# EAGLE design PGTN016_slope (EAGLE 8.5.2)
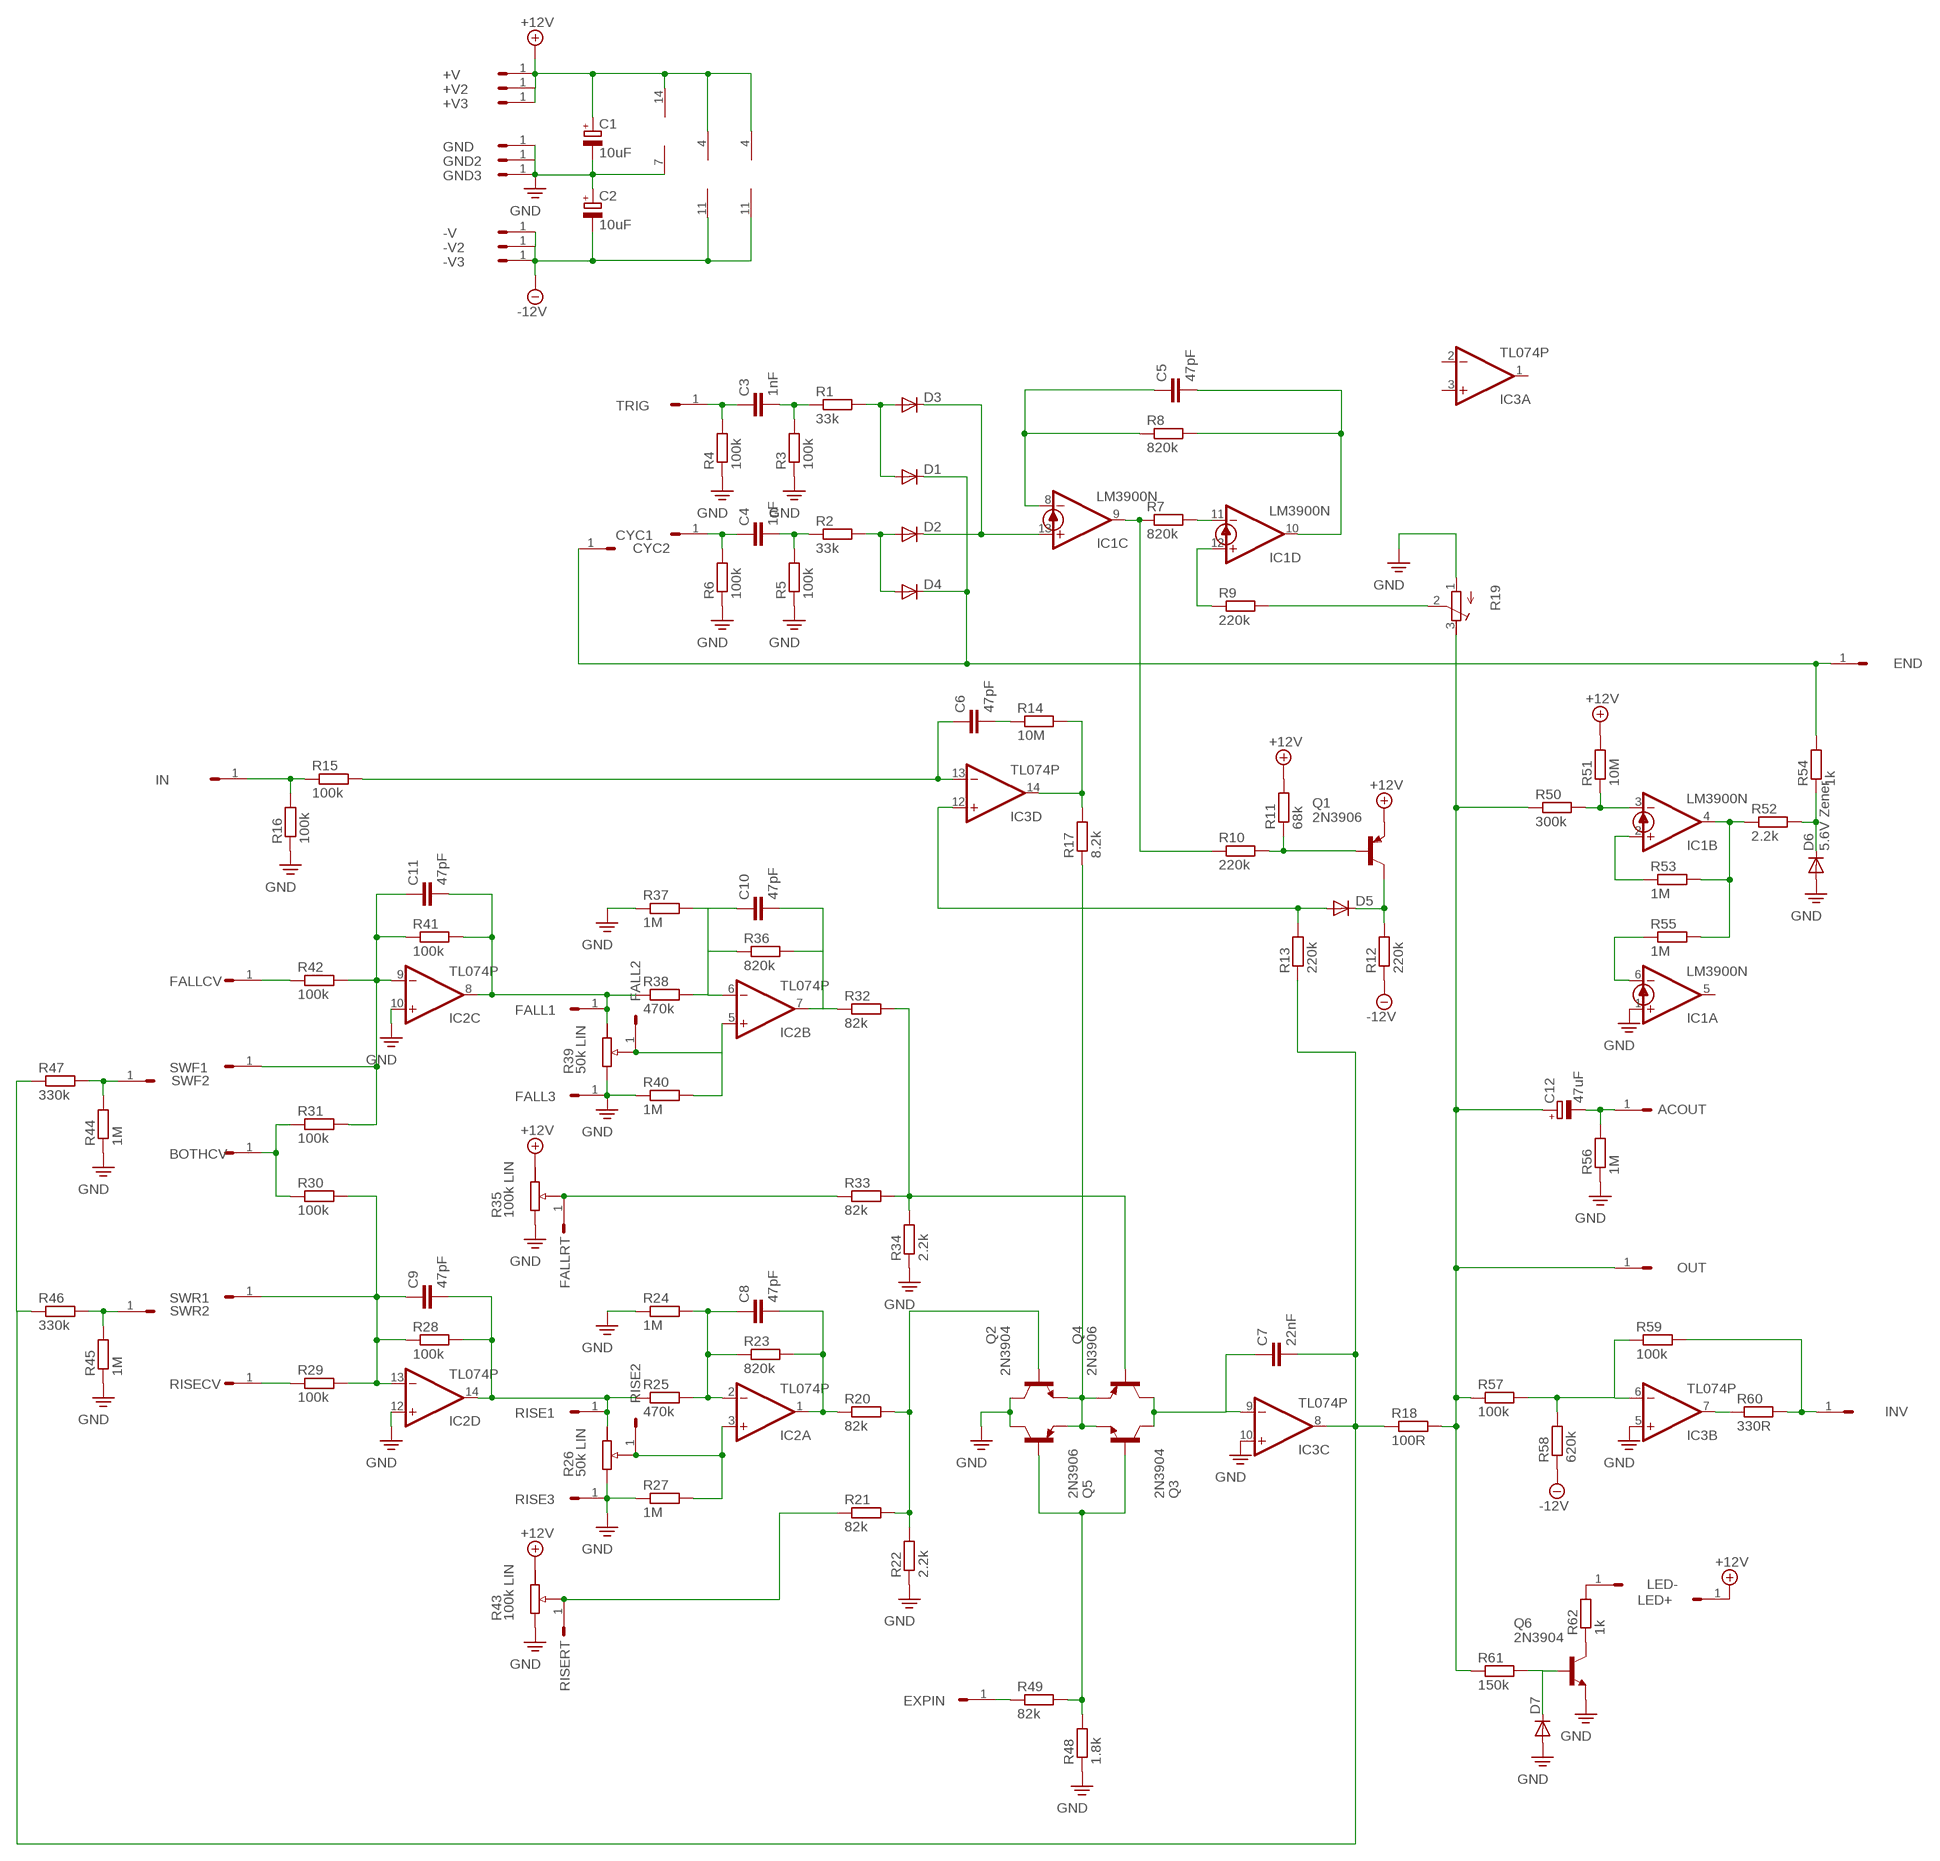
[diagram p0: schematic, sheet 1]

## Parts
+V  HEADER/MALE/01  [HEADER/MALE/01]
+V2  HEADER/MALE/01  [HEADER/MALE/01]
+V3  HEADER/MALE/01  [HEADER/MALE/01]
-V  HEADER/MALE/01  [HEADER/MALE/01]
-V2  HEADER/MALE/01  [HEADER/MALE/01]
-V3  HEADER/MALE/01  [HEADER/MALE/01]
ACOUT  HEADER/MALE/01  [HEADER/MALE/01]
BOTHCV  HEADER/MALE/01  [HEADER/MALE/01]
C1  10uF  CAPACITOR/POLARIZEDE2.5-6  [E2,5-6]
C2  10uF  CAPACITOR/POLARIZEDE2.5-6  [E2,5-6]
C3  1nF  CAPACITORCERAMICDISC/5  [CERAMICDISC/5]
C4  1nF  CAPACITORCERAMICDISC/5  [CERAMICDISC/5]
C5  47pF  CAPACITORCERAMICDISC/5  [CERAMICDISC/5]
C6  47pF  CAPACITORCERAMICDISC/5  [CERAMICDISC/5]
C7  22nF  CAPACITORCERAMICDISC/5  [CERAMICDISC/5]
C8  47pF  CAPACITORCERAMICDISC/5  [CERAMICDISC/5]
C9  47pF  CAPACITORCERAMICDISC/5  [CERAMICDISC/5]
C10  47pF  CAPACITORCERAMICDISC/5  [CERAMICDISC/5]
C11  47pF  CAPACITORCERAMICDISC/5  [CERAMICDISC/5]
C12  47uF  CAPACITOR/POLARIZEDE2.5-6  [E2,5-6]
CYC1  HEADER/MALE/01  [HEADER/MALE/01]
CYC2  HEADER/MALE/01  [HEADER/MALE/01]
D1  1N4148DO35-7  [DO35-7]
D2  1N4148DO35-7  [DO35-7]
D3  1N4148DO35-7  [DO35-7]
D4  1N4148DO35-7  [DO35-7]
D5  1N4148DO35-7  [DO35-7]
D6  5.6V Zener  1N4148DO35-7  [DO35-7]
D7  1N4148DO35-7  [DO35-7]
END  HEADER/MALE/01  [HEADER/MALE/01]
EXPIN  HEADER/MALE/01  [HEADER/MALE/01]
FALL1  HEADER/MALE/01  [HEADER/MALE/01]
FALL2  HEADER/MALE/01  [HEADER/MALE/01]
FALL3  HEADER/MALE/01  [HEADER/MALE/01]
FALLCV  HEADER/MALE/01  [HEADER/MALE/01]
FALLRT  HEADER/MALE/01  [HEADER/MALE/01]
GND  HEADER/MALE/01  [HEADER/MALE/01]
GND2  HEADER/MALE/01  [HEADER/MALE/01]
GND3  HEADER/MALE/01  [HEADER/MALE/01]
IC1  LM3900N  [DIL14]
IC2  TL074P  [DIL14]
IC3  TL074P  [DIL14]
IN  HEADER/MALE/01  [HEADER/MALE/01]
INV  HEADER/MALE/01  [HEADER/MALE/01]
LED+  HEADER/MALE/01  [HEADER/MALE/01]
LED-  HEADER/MALE/01  [HEADER/MALE/01]
OUT  HEADER/MALE/01  [HEADER/MALE/01]
Q1  2N3906  [TO92]
Q2  2N3904  [TO92]
Q3  2N3904  [TO92]
Q4  2N3906  [TO92]
Q5  2N3906  [TO92]
Q6  2N3904  [TO92]
R1  33k  RESISTORRESISTOR/UPRIGHT/7.5  [RESISTOR/7.5]
R2  33k  RESISTORRESISTOR/UPRIGHT/7.5  [RESISTOR/7.5]
R3  100k  RESISTORRESISTOR/UPRIGHT/7.5  [RESISTOR/7.5]
R4  100k  RESISTORRESISTOR/UPRIGHT/7.5  [RESISTOR/7.5]
R5  100k  RESISTORRESISTOR/UPRIGHT/7.5  [RESISTOR/7.5]
R6  100k  RESISTORRESISTOR/UPRIGHT/7.5  [RESISTOR/7.5]
R7  820k  RESISTORRESISTOR/UPRIGHT/7.5  [RESISTOR/7.5]
R8  820k  RESISTORRESISTOR/UPRIGHT/7.5  [RESISTOR/7.5]
R9  220k  RESISTORRESISTOR/UPRIGHT/7.5  [RESISTOR/7.5]
R10  220k  RESISTORRESISTOR/UPRIGHT/7.5  [RESISTOR/7.5]
R11  68k  RESISTORRESISTOR/UPRIGHT/7.5  [RESISTOR/7.5]
R12  220k  RESISTORRESISTOR/UPRIGHT/7.5  [RESISTOR/7.5]
R13  220k  RESISTORRESISTOR/UPRIGHT/7.5  [RESISTOR/7.5]
R14  10M  RESISTORRESISTOR/UPRIGHT/7.5  [RESISTOR/7.5]
R15  100k  RESISTORRESISTOR/UPRIGHT/7.5  [RESISTOR/7.5]
R16  100k  RESISTORRESISTOR/UPRIGHT/7.5  [RESISTOR/7.5]
R17  8.2k  RESISTORRESISTOR/UPRIGHT/7.5  [RESISTOR/7.5]
R18  100R  RESISTORRESISTOR/UPRIGHT/7.5  [RESISTOR/7.5]
R19  TRIMMER64X  [TRIMMER/64B]
R20  82k  RESISTORRESISTOR/UPRIGHT/7.5  [RESISTOR/7.5]
R21  82k  RESISTORRESISTOR/UPRIGHT/7.5  [RESISTOR/7.5]
R22  2.2k  RESISTORRESISTOR/UPRIGHT/7.5  [RESISTOR/7.5]
R23  820k  RESISTORRESISTOR/UPRIGHT/7.5  [RESISTOR/7.5]
R24  1M  RESISTORRESISTOR/UPRIGHT/7.5  [RESISTOR/7.5]
R25  470k  RESISTORRESISTOR/UPRIGHT/7.5  [RESISTOR/7.5]
R26  50k LIN  POTENTIOMETER  (no package)
R27  1M  RESISTORRESISTOR/UPRIGHT/7.5  [RESISTOR/7.5]
R28  100k  RESISTORRESISTOR/UPRIGHT/7.5  [RESISTOR/7.5]
R29  100k  RESISTORRESISTOR/UPRIGHT/7.5  [RESISTOR/7.5]
R30  100k  RESISTORRESISTOR/UPRIGHT/7.5  [RESISTOR/7.5]
R31  100k  RESISTORRESISTOR/UPRIGHT/7.5  [RESISTOR/7.5]
R32  82k  RESISTORRESISTOR/UPRIGHT/7.5  [RESISTOR/7.5]
R33  82k  RESISTORRESISTOR/UPRIGHT/7.5  [RESISTOR/7.5]
R34  2.2k  RESISTORRESISTOR/UPRIGHT/7.5  [RESISTOR/7.5]
R35  100k LIN  POTENTIOMETER  (no package)
R36  820k  RESISTORRESISTOR/UPRIGHT/7.5  [RESISTOR/7.5]
R37  1M  RESISTORRESISTOR/UPRIGHT/7.5  [RESISTOR/7.5]
R38  470k  RESISTORRESISTOR/UPRIGHT/7.5  [RESISTOR/7.5]
R39  50k LIN  POTENTIOMETER  (no package)
R40  1M  RESISTORRESISTOR/UPRIGHT/7.5  [RESISTOR/7.5]
R41  100k  RESISTORRESISTOR/UPRIGHT/7.5  [RESISTOR/7.5]
R42  100k  RESISTORRESISTOR/UPRIGHT/7.5  [RESISTOR/7.5]
R43  100k LIN  POTENTIOMETER  (no package)
R44  1M  RESISTORRESISTOR/UPRIGHT/7.5  [RESISTOR/7.5]
R45  1M  RESISTORRESISTOR/UPRIGHT/7.5  [RESISTOR/7.5]
R46  330k  RESISTORRESISTOR/UPRIGHT/7.5  [RESISTOR/7.5]
R47  330k  RESISTORRESISTOR/UPRIGHT/7.5  [RESISTOR/7.5]
R48  1.8k  RESISTORRESISTOR/UPRIGHT/7.5  [RESISTOR/7.5]
R49  82k  RESISTORRESISTOR/UPRIGHT/7.5  [RESISTOR/7.5]
R50  300k  RESISTORRESISTOR/UPRIGHT/7.5  [RESISTOR/7.5]
R51  10M  RESISTORRESISTOR/UPRIGHT/7.5  [RESISTOR/7.5]
R52  2.2k  RESISTORRESISTOR/UPRIGHT/7.5  [RESISTOR/7.5]
R53  1M  RESISTORRESISTOR/UPRIGHT/7.5  [RESISTOR/7.5]
R54  1k  RESISTORRESISTOR/UPRIGHT/7.5  [RESISTOR/7.5]
R55  1M  RESISTORRESISTOR/UPRIGHT/7.5  [RESISTOR/7.5]
R56  1M  RESISTORRESISTOR/UPRIGHT/7.5  [RESISTOR/7.5]
R57  100k  RESISTORRESISTOR/UPRIGHT/7.5  [RESISTOR/7.5]
R58  620k  RESISTORRESISTOR/UPRIGHT/7.5  [RESISTOR/7.5]
R59  100k  RESISTORRESISTOR/UPRIGHT/7.5  [RESISTOR/7.5]
R60  330R  RESISTORRESISTOR/UPRIGHT/7.5  [RESISTOR/7.5]
R61  150k  RESISTORRESISTOR/UPRIGHT/7.5  [RESISTOR/7.5]
R62  1k  RESISTORRESISTOR/UPRIGHT/7.5  [RESISTOR/7.5]
RISE1  HEADER/MALE/01  [HEADER/MALE/01]
RISE2  HEADER/MALE/01  [HEADER/MALE/01]
RISE3  HEADER/MALE/01  [HEADER/MALE/01]
RISECV  HEADER/MALE/01  [HEADER/MALE/01]
RISERT  HEADER/MALE/01  [HEADER/MALE/01]
SWF1  HEADER/MALE/01  [HEADER/MALE/01]
SWF2  HEADER/MALE/01  [HEADER/MALE/01]
SWR1  HEADER/MALE/01  [HEADER/MALE/01]
SWR2  HEADER/MALE/01  [HEADER/MALE/01]
TRIG  HEADER/MALE/01  [HEADER/MALE/01]

## Nets
+12V: +V2.1 +V3.1 +V.1 C1.+ IC1.14(P:V+) IC2.4(P:V+) IC3.4(P:V+) LED+.1 Q1.3(E) R11.2 R35.A R43.A R51.2
-12V: -V2.1 -V3.1 -V.1 C2.- IC2.11(P:V-) IC3.11(P:V-) R12.1 R58.1
GND: C1.- C2.+ D6.A D7.A FALL3.1 GND2.1 GND3.1 GND.1 IC1.1(A:+IN) IC1.7(P:GND) IC2.10(C:+IN) IC2.12(D:+IN) IC3.5(B:+IN) IC3.10(C:+IN) Q2.1(C) Q5.1(C) Q6.3(E) R3.1 R4.1 R5.1 R6.1 R16.1 R19.1(E) R22.1 R24.1 R26.E R27.1 R34.1 R35.E R37.1 R39.E R40.1 R43.E R44.1 R45.1 R48.1 R56.1 RISE3.1
N$1: C4.2 R2.1 R5.2
N$2: C4.1 CYC1.1 R6.2
N$3: D2.C D3.C IC1.13(C:+IN)
N$4: Q1.2(B) R10.2 R11.1
N$5: CYC2.1 D1.C D4.C END.1 R54.2
N$6: D2.A D4.A R2.2
N$7: D1.A D3.A R1.2
N$8: C3.2 R1.1 R3.2
N$9: C3.1 R4.2 TRIG.1
N$10: IC1.9(C:OUT) R7.1 R10.1
N$11: IC1.11(D:-IN) R7.2
N$12: C5.2 IC1.10(D:OUT) R8.2
N$13: C5.1 IC1.8(C:-IN) R8.1
N$14: IC1.12(D:+IN) R9.1
N$15: D5.C Q1.1(C) R12.2
N$16: D5.A IC3.12(D:+IN) R13.2
N$17: Q2.3(E) Q3.3(E) Q4.3(E) Q5.3(E) R17.1
N$18: IC3.14(D:OUT) R14.2 R17.2
N$19: C6.2 R14.1
N$20: C6.1 IC3.13(D:-IN) R15.2
N$21: IN.1 R15.1 R16.2
N$22: EXPIN.1 R49.1
N$23: C7.1 IC3.9(C:-IN) Q3.1(C) Q4.1(C)
N$24: C12.+ OUT.1 R18.2 R19.3(A) R50.1 R57.1 R61.1
N$25: Q3.2(B) Q5.2(B) R48.2 R49.2
N$26: R9.2 R19.2(S)
N$27: IC2.3(A:+IN) R26.S R27.2 RISE2.1
N$28: Q2.2(B) R20.2 R21.2 R22.2
N$29: C8.2 IC2.1(A:OUT) R20.1 R23.2
N$30: C8.1 IC2.2(A:-IN) R23.1 R24.2 R25.2
N$31: BOTHCV.1 R30.1 R31.1
N$32: C10.2 IC2.7(B:OUT) R32.1 R36.2
N$33: Q4.2(B) R32.2 R33.2 R34.2
N$34: C9.2 IC2.14(D:OUT) R25.1 R26.A R28.2 RISE1.1
N$35: C9.1 IC2.13(D:-IN) R28.1 R29.2 R30.2 SWR1.1
N$36: R29.1 RISECV.1
N$37: C10.1 IC2.6(B:-IN) R36.1 R37.2 R38.2
N$38: FALLRT.1 R33.1 R35.S
N$39: FALL2.1 IC2.5(B:+IN) R39.S R40.2
N$40: C11.1 IC2.9(C:-IN) R31.2 R41.1 R42.2 SWF1.1
N$41: R21.1 R43.S RISERT.1
N$42: C11.2 FALL1.1 IC2.8(C:OUT) R38.1 R39.A R41.2
N$43: FALLCV.1 R42.1
N$44: R45.2 R46.2 SWR2.1
N$45: R44.2 R47.2 SWF2.1
N$46: C7.2 IC3.8(C:OUT) R13.1 R18.1 R46.1 R47.1
N$47: IC1.3(B:-IN) R50.2 R51.1
N$48: IC1.4(B:OUT) R52.1 R53.2 R55.2
N$49: IC1.6(A:-IN) R55.1
N$50: IC1.2(B:+IN) R53.1
N$51: D6.C R52.2 R54.1
N$52: ACOUT.1 C12.- R56.2
N$53: IC3.6(B:-IN) R57.2 R58.2 R59.1
N$54: IC3.7(B:OUT) R60.1
N$55: INV.1 R59.2 R60.2
N$57: D7.C Q6.2(B) R61.2
N$58: Q6.1(C) R62.1
N$59: LED-.1 R62.2
Unconnected: IC1.5(A:OUT) IC3.1(A:OUT) IC3.2(A:-IN) IC3.3(A:+IN)

## Library data of the parts
+V +V2 +V3 -V -V2 -V3 ACOUT BOTHCV CYC1 CYC2 END EXPIN FALL1-FALL3 FALLCV FALLRT GND GND2 GND3 IN INV LED+ LED- OUT RISE1-RISE3 RISECV RISERT SWF1 SWF2 SWR1 SWR2 TRIG = connectors:HEADER/MALE/01; SPICEPREFIX: X
C1 C2 = capacitors:CAPACITOR/POLARIZED: POLARIZED CAPACITOR, European symbol; SPICEPREFIX: C
C3-C11 = capacitors:CAPACITOR: CAPACITOR, European symbol
C12 = capacitors:CAPACITOR/POLARIZED: POLARIZED CAPACITOR, European symbol
D1-D7 = transistors:1N4148: DIODE high speed (Philips)
IC1 = ic_analogue:LM3900: OP AMP
IC2 IC3 = ic_analogue:TL074: OP AMP
Q1 Q4 Q5 = transistors:2N3906: PNP Transistor
Q2 Q3 Q6 = transistors:2N3904: NPN Transistor
R1-R18 R20-R25 R27-R34 R36-R38 R40-R42 R44-R62 = resistors:RESISTOR: RESISTOR, European symbol
R19 = resistors:TRIMMER: Trimm resistor
R26 R35 R39 R43 = controls_off_brd:POTENTIOMETER: Trimm resistor; _EXTERNAL_: 1

## Board
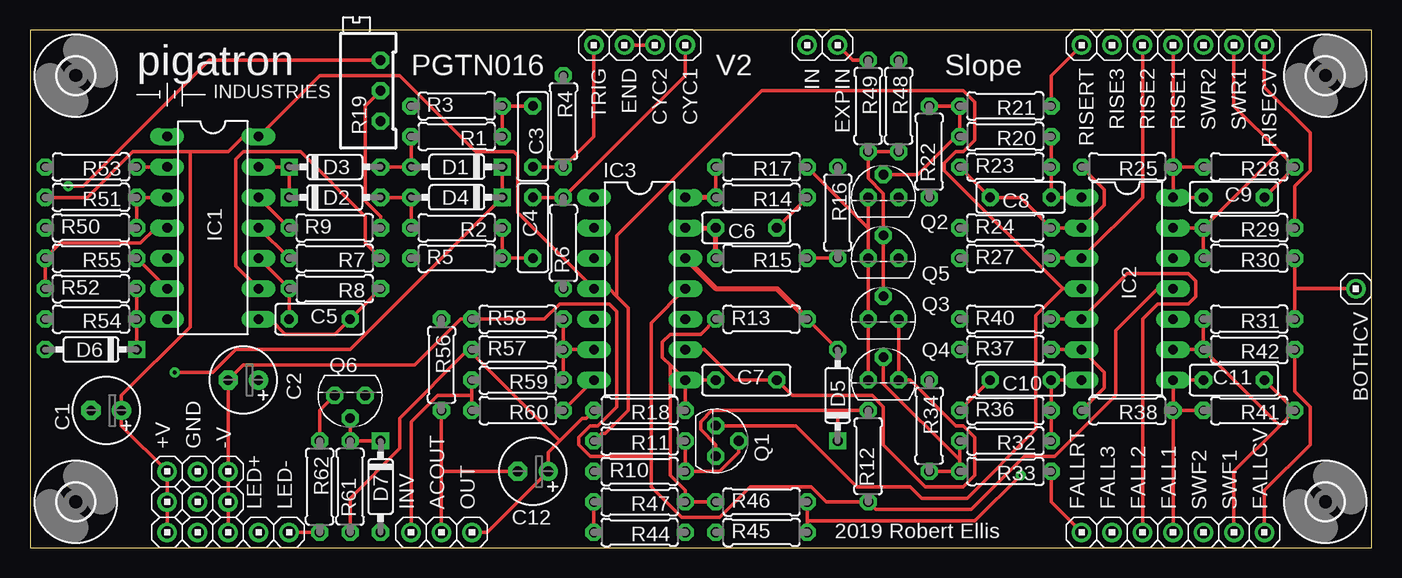
[diagram p1: board, top side]
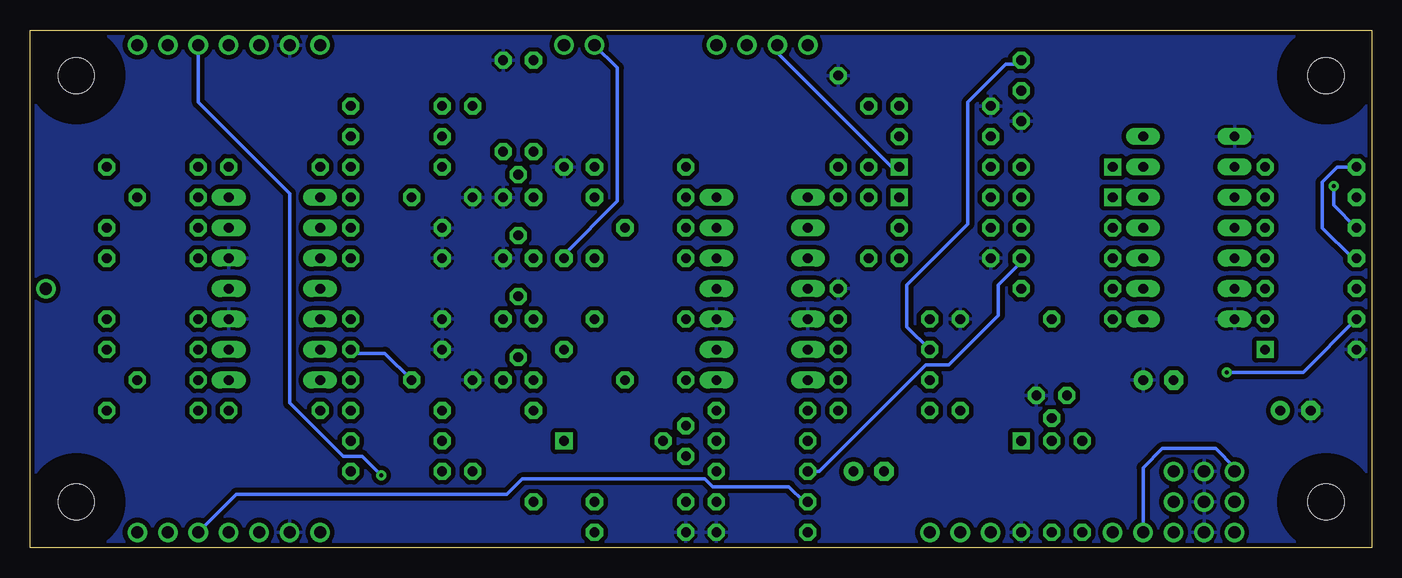
[diagram p2: board, bottom side, seen from below]

Size 111.81 x 43.17 mm. Coordinates in mm from the lower left corner, seen from the top.
Outline: 0,0 111.81,0 111.81,43.17 0,43.17 0,0
Copper layers (1*16): Top 0.0356mm / dielectric 1.5011mm / Bottom 0.0356mm
Design rules "pigatron": minimum track width 12mil, minimum drill 13mil, track to track 15mil, track to pad 10mil, pad to pad 10mil, via to via 10mil, smd to smd 6mil, copper to edge 15mil, drill to drill 10mil, minimum pad ring 12mil, minimum via ring 10mil, stop-mask expansion 4mil, vias tented up to drill 0mil, thermal gap 10mil

### Footprints (pad centres in the part's own frame; a part is rotated, then mirrored left to right if it is on the bottom)
HEADER/MALE/01 = drill 1.016: 1 0,0
E2,5-6 = drill 0.813 pad 1.6: + -1.27,0 | drill 0.813 pad 1.6 octagon: - 1.27,0
CERAMICDISC/5 = drill 0.813 octagon: 1 -2.54,0; 2 2.54,0
DO35-7 = drill 0.813 octagon: A 3.81,0 | drill 0.813 square: C -3.81,0
DIL14 = drill 0.813 long: 1 -7.62,-3.81; 2 -5.08,-3.81; 3 -2.54,-3.81; 4 0,-3.81; 5 2.54,-3.81; 6 5.08,-3.81; 7 7.62,-3.81; 8 7.62,3.81; 9 5.08,3.81; 10 2.54,3.81; 11 0,3.81; 12 -2.54,3.81; 13 -5.08,3.81; 14 -7.62,3.81
TO92 = drill 0.813 octagon: 1 1.27,0; 2 0,1.905; 3 -1.27,0
RESISTOR/7.5 = drill 0.813 octagon: 1 -3.81,0; 2 3.81,0
TRIMMER/64B = drill 0.813 octagon: 1 1.27,-2.54; 2 1.27,0; 3 1.27,2.54
STANDOFF/3.0 = hole 3: 0,0

### Placement (x,y rotation side)
+V  11.43,6.35 90 top
+V2  11.43,3.81 90 top
+V3  11.43,1.27 90 top
-V  16.51,6.35 90 top
-V2  16.51,3.81 90 top
-V3  16.51,1.27 90 top
ACOUT  34.29,1.27 90 top
BOTHCV  110.49,21.59 270 top
C1  6.35,11.43 180 top
C2  17.78,13.97 180 top
C3  41.91,34.29 90 top
C4  41.91,26.67 270 top
C5  24.13,19.05 180 top
C6  59.69,26.67 0 top
C7  59.69,13.97 180 top
C8  82.55,29.21 0 top
C9  100.33,29.21 180 top
C10  82.55,13.97 0 top
C11  100.33,13.97 180 top
C12  41.91,6.35 180 top
CYC1  54.61,41.91 270 top
CYC2  52.07,41.91 270 top
D1  35.56,31.75 180 top
D2  25.4,29.21 0 top
D3  25.4,31.75 0 top
D4  35.56,29.21 180 top
D5  67.31,12.7 90 top
D6  5.08,16.51 180 top
D7  29.21,5.08 270 top
END  49.53,41.91 270 top
EXPIN  67.31,41.91 270 top
FALL1  95.25,1.27 90 top
FALL2  92.71,1.27 90 top
FALL3  90.17,1.27 90 top
FALLCV  102.87,1.27 90 top
FALLRT  87.63,1.27 90 top
GND  13.97,6.35 90 top
GND2  13.97,1.27 90 top
GND3  13.97,3.81 90 top
IC1  15.24,26.67 270 top
IC2  91.44,21.59 270 top
IC3  50.8,21.59 270 top
IN  64.77,41.91 270 top
INV  31.75,1.27 90 top
LED+  19.05,1.27 90 top
LED-  21.59,1.27 90 top
OUT  36.83,1.27 90 top
Q1  57.15,8.89 270 top
Q2  71.12,29.21 0 top
Q3  71.12,19.05 0 top
Q4  71.12,13.97 0 top
Q5  71.12,24.13 0 top
Q6  26.67,12.7 180 top
R1  35.56,34.29 180 top
R2  35.56,26.67 180 top
R3  35.56,36.83 0 top
R4  44.45,35.56 270 top
R5  35.56,24.13 0 top
R6  44.45,25.4 90 top
R7  25.4,24.13 180 top
R8  25.4,21.59 180 top
R9  25.4,26.67 0 top
R10  50.8,6.35 0 top
R11  50.8,8.89 180 top
R12  69.85,7.62 90 top
R13  60.96,19.05 0 top
R14  60.96,29.21 180 top
R15  60.96,24.13 180 top
R16  67.31,27.94 270 top
R17  60.96,31.75 180 top
R18  50.8,11.43 180 top
R19  27.94,38.1 0 top
R20  81.28,34.29 180 top
R21  81.28,36.83 180 top
R22  74.93,33.02 90 top
R23  81.28,31.75 0 top
R24  81.28,26.67 0 top
R25  91.44,31.75 180 top
R27  81.28,24.13 0 top
R28  101.6,31.75 180 top
R29  101.6,26.67 180 top
R30  101.6,24.13 180 top
R31  101.6,19.05 180 top
R32  81.28,8.89 180 top
R33  81.28,6.35 180 top
R34  74.93,10.16 270 top
R36  81.28,11.43 0 top
R37  81.28,16.51 0 top
R38  91.44,11.43 180 top
R40  81.28,19.05 0 top
R41  101.6,11.43 180 top
R42  101.6,16.51 180 top
R44  50.8,1.27 180 top
R45  60.96,1.27 0 top
R46  60.96,3.81 0 top
R47  50.8,3.81 180 top
R48  72.39,36.83 270 top
R49  69.85,36.83 270 top
R50  5.08,26.67 0 top
R51  5.08,29.21 180 top
R52  5.08,21.59 0 top
R53  5.08,31.75 180 top
R54  5.08,19.05 180 top
R55  5.08,24.13 180 top
R56  34.29,15.24 270 top
R57  40.64,16.51 0 top
R58  40.64,19.05 0 top
R59  40.64,13.97 180 top
R60  40.64,11.43 180 top
R61  26.67,5.08 90 top
R62  24.13,5.08 270 top
RISE1  95.25,41.91 270 top
RISE2  92.71,41.91 270 top
RISE3  90.17,41.91 270 top
RISECV  102.87,41.91 270 top
RISERT  87.63,41.91 270 top
SWF1  100.33,1.27 90 top
SWF2  97.79,1.27 90 top
SWR1  100.33,41.91 270 top
SWR2  97.79,41.91 270 top
TRIG  46.99,41.91 270 top
U$1  [STANDOFF/3.0]  107.95,3.81 0 top
U$2  [STANDOFF/3.0]  107.95,39.37 0 top
U$3  [STANDOFF/3.0]  3.81,3.81 0 top
U$4  [STANDOFF/3.0]  3.81,39.37 0 top
U$5  [PIGATRON-LOGO]  17.78,39.37 0 top

### Tracks (layer width: path | path; a pad name or v marks a point on that pad's centre or on a via)
+12V
  Top 0.305: Q1.3 63.82,10.16 68.9,5.08 73.34,5.08 74.3,4.13 78.11,4.13 83.82,9.84 83.82,19.37 86.04,21.59 | IC2.4 86.04,21.59 | R11.2 47.62,9.53 47.94,9.53 49.85,11.43 49.85,20 48.89,20.95 | 48.89,20.95 48.26,21.59 IC3.4 40.64,27.94 40.64,32.7 40.32,33.02 37.15,33.02 30.8,39.37 24.13,39.37 IC1.14 17.78,34.29 16.51,33.02 13.33,33.02 | R51.2 4.76,29.21 8.57,33.02 13.33,33.02 | 13.33,33.02 13.33,18.41 7.62,12.7 C1.+ 7.62,10.16 +V.1 +V2.1 +V3.1 | 86.04,21.59 76.2,31.43 76.2,32.07 77.15,33.02 77.79,33.02 78.74,33.97 78.74,37.15 77.79,38.1 60.96,38.1 48.89,26.03 48.89,20.95
  Bottom 0.305: LED+.1 19.05,6.67 17.46,8.26 13.02,8.26 11.43,6.67 +V.1
-12V
  Top 0.305: -V3.1 -V2.1 -V.1 C2.- 17.78,15.24 32.07,15.24 35.88,19.05 R58.1 42.86,19.05 44.13,20.32 48.26,20.32 48.89,19.69 48.89,11.75 47.31,10.16 46.67,10.16 45.72,9.21 45.72,8.57 46.67,7.62 51.75,7.62 | 51.75,7.62 51.75,18.73 IC3.11 | 51.75,7.62 51.75,5.08 54.29,2.54 57.47,2.54 60.01,5.08 65.09,5.08 66.36,3.81 R12.1 70.48,3.18 78.42,3.18 82.87,7.62 85.41,7.62 90.49,12.7 90.49,18.1 93.98,21.59 IC2.11
GND
  pour Bottom: 0,43.18 0,0 111.76,0 111.76,43.18
N$1
  Top 0.305: R2.1 R5.2 C4.2
N$2
  Top 0.305: C4.1 R6.2 54.61,39.37 CYC1.1
N$3
  Top 0.305: IC1.13 D3.C D2.C
N$4
  Top 0.305: R11.1 R10.2 57.47,6.35 59.05,7.94 Q1.2
N$5  (via drill 0.33)
  Top 0.305: D1.C D4.C 26.67,16.51 17.14,16.51 15.24,14.6 v12.06,14.6 | CYC2.1 END.1
  Bottom 0.305: END.1 49.53,41.27 40,31.75 D1.C | R54.2 5.71,14.6 v12.06,14.6
N$6
  Top 0.305: R2.2 D4.A D2.A
N$7
  Top 0.305: D3.A D1.A R1.2
N$8
  Top 0.305: R1.1 R3.2 C3.2
N$9
  Top 0.305: C3.1 R4.2 46.99,34.29 TRIG.1
N$10
  Top 0.305: IC1.9 17.14,23.49 17.14,32.38 17.78,33.02 22.54,33.02 27.94,27.62 27.94,25.4 R7.1
  Bottom 0.305: R10.1 46.04,6.35 37.15,15.24 35.24,15.24 31.11,19.37 31.11,21.91 29.21,23.81 R7.1
N$11
  Top 0.305: R7.2 IC1.11
N$12
  Top 0.305: C5.2 R8.2 IC1.10
N$13
  Top 0.305: IC1.8 20,19.05 21.27,17.78 25.4,17.78 C5.1 R8.1
N$14
  Top 0.305: R9.1 IC1.12
N$15
  Top 0.305: Q1.1 57.15,8.57 55.88,9.84 55.88,10.48 56.83,11.43 67.31,11.43 | R12.2 67.31,11.43 | 67.31,11.43 D5.C
N$16
  Top 0.305: D5.A R13.2
  Top 0.406: IC3.12 57.15,21.59 62.23,21.59 R13.2
N$17
  Top 0.305: Q4.3 Q3.3 Q5.3 69.85,26.67 | Q2.3 69.85,26.67 | 69.85,26.67 R17.1
N$18
  Top 0.305: R14.2 R17.2
  Top 0.406: R14.2 IC3.14
N$19
  Top 0.305: R14.1 C6.2
N$20
  Top 0.406: IC3.13 C6.1 R15.2
N$21
  Top 0.305: R16.2 R15.1
  Bottom 0.305: IN.1 62.86,40 62.86,28.89 67.31,24.45 R16.2
N$22
  Top 0.305: R49.1 68.58,40.64 EXPIN.1
N$23
  Top 0.305: Q3.1 Q4.1 73.34,13.97 77.15,10.16 77.79,10.16 78.74,9.21 78.74,6.03 77.79,5.08 74.61,5.08 71.12,8.57 71.12,11.75 70.17,12.7 63.5,12.7 C7.1 58.74,13.97 56.2,16.51 IC3.9
N$24  (via drill 0.33)
  Top 0.305: R18.2 46.35,10.79 46.04,10.79 44.13,8.89 | 44.13,8.89 43.18,7.94 C12.+ 38.1,1.27 OUT.1 | R61.1 26.67,4.13 30.8,8.26 30.8,10.79 36.51,16.51 | 36.51,16.51 44.13,8.89 | 36.51,16.51 R57.1 | v3.18,30.16 4.45,30.16 14.92,40.64 R19.3
  Bottom 0.305: R50.1 3.18,28.57 v3.18,30.16 | R57.1 38.73,18.41 38.73,21.91 33.66,26.99 33.66,37.15 30.48,40.32 29.53,40.32 R19.3
N$25
  Top 0.305: R48.2 R49.2 69.85,30.8 71.12,29.53 Q5.2 Q3.2
N$26
  Top 0.305: R9.2 29.21,27.62 27.94,28.89 27.94,36.83 R19.2
N$27
  Top 0.305: R27.2 IC2.3 92.71,29.21 RISE2.1
N$28
  Top 0.305: R22.2 R21.2 R20.2 77.15,34.29 73.98,31.12 Q2.2
N$29
  Top 0.305: IC2.1 C8.2 R23.2 R20.1
N$30
  Top 0.305: R23.1 C8.1 82.55,29.21 R24.2 IC2.2 89.53,28.57 89.53,29.84 R25.2
N$31
  Top 0.305: R30.1 105.41,21.59 | 105.41,21.59 R31.1 | 105.41,21.59 BOTHCV.1
N$32
  Top 0.305: R32.1 R36.2 C10.2 IC2.7
N$33
  Top 0.305: R34.2 R33.2 77.47,7.3 | 77.47,7.3 R32.2 | Q4.2 71.12,13.65 77.47,7.3
N$34
  Top 0.305: R25.1 IC2.14 C9.2 | R25.1 R28.2 | R25.1 RISE1.1
N$35
  Top 0.305: R29.2 R30.2 | R29.2 IC2.13 | C9.1 R28.1 104.14,33.02 | SWR1.1 100.33,36.83 104.14,33.02 | 104.14,33.02 R29.2
N$36
  Top 0.305: R29.1 105.41,30.16 106.68,31.43 106.68,34.61 102.87,38.42 RISECV.1
N$37
  Top 0.305: C10.1 R36.1 | R38.2 89.53,13.33 89.53,14.6 IC2.6 R37.2
  Bottom 0.305: C10.1 82.23,16.19 84.77,16.19 R37.2
N$38
  Top 0.305: R33.1 85.09,3.81 FALLRT.1
N$39
  Top 0.305: R40.2 IC2.5 91.44,22.86 96.52,22.86 97.16,22.23 97.16,20.95 96.52,20.32 93.98,20.32 92.71,19.05 FALL2.1
N$40
  Top 0.305: R42.2 IC2.9 | R42.2 R31.2 | C11.1 R41.1 104.14,10.16 | SWF1.1 100.33,6.35 104.14,10.16 | 104.14,10.16 R42.2
N$41
  Top 0.305: R21.1 85.09,39.37 RISERT.1
N$42
  Top 0.305: R38.1 IC2.8 C11.2 | R38.1 R41.2 | R38.1 FALL1.1
N$43
  Top 0.305: R42.1 105.41,13.02 106.68,11.75 106.68,8.57 102.87,4.76 FALLCV.1
N$44  (via drill 0.33)
  Top 0.305: R46.2 64.77,2.22 | 64.77,2.22 R45.2 | v82.55,6.03 78.74,2.22 64.77,2.22
  Bottom 0.305: SWR2.1 97.79,37.15 90.17,29.53 90.17,12.06 85.72,7.62 84.14,7.62 v82.55,6.03
N$45
  Top 0.305: R47.2 R44.2
  Bottom 0.305: SWF2.1 94.61,4.45 72.07,4.45 70.8,5.71 55.56,5.71 54.93,5.08 48.58,5.08 47.31,3.81 R47.2
N$46
  Top 0.305: R46.1 R47.1 54.61,4.76 53.34,6.03 53.34,15.24 | IC3.8 R18.1 | IC3.8 C7.2 | R13.1 55.88,17.78 53.34,17.78 52.7,17.15 52.7,15.88 53.34,15.24 | IC3.8 53.34,15.24
N$47
  Top 0.305: R50.2 R51.1 IC1.3
N$48
  Top 0.305: R52.1 R55.2 2.54,25.4 9.21,25.4 10.48,26.67 IC1.4
  Bottom 0.305: R53.2 2.86,31.75 4.13,30.48 4.13,26.67 1.59,24.13 R55.2
N$49
  Top 0.305: IC1.6 R55.1
N$50
  Top 0.305: IC1.2 R53.1
N$51
  Top 0.305: D6.C R54.1 R52.2
N$52
  Top 0.305: ACOUT.1 34.29,6.35 | 34.29,6.35 R56.2 | 34.29,6.35 C12.-
N$53
  Top 0.305: R57.2 R59.1 | R57.2 IC3.6 | R57.2 R58.2
N$54
  Top 0.305: IC3.7 R60.1
N$55
  Top 0.305: R59.2 36.83,12.7 | 36.83,12.7 R60.2 | INV.1 31.75,10.48 33.97,12.7 36.83,12.7
N$57
  Top 0.305: Q6.2 R61.2 D7.C
N$58
  Top 0.305: R62.1 24.13,11.43 Q6.1
N$59
  Top 0.305: LED-.1 R62.2

### Text on the board
tNames: PGTN016 | V2 | Slope | 2019 Robert Ellis